# EAGLE schematic Diagrama Eletrônico V2.0 (EAGLE 9.5.1)
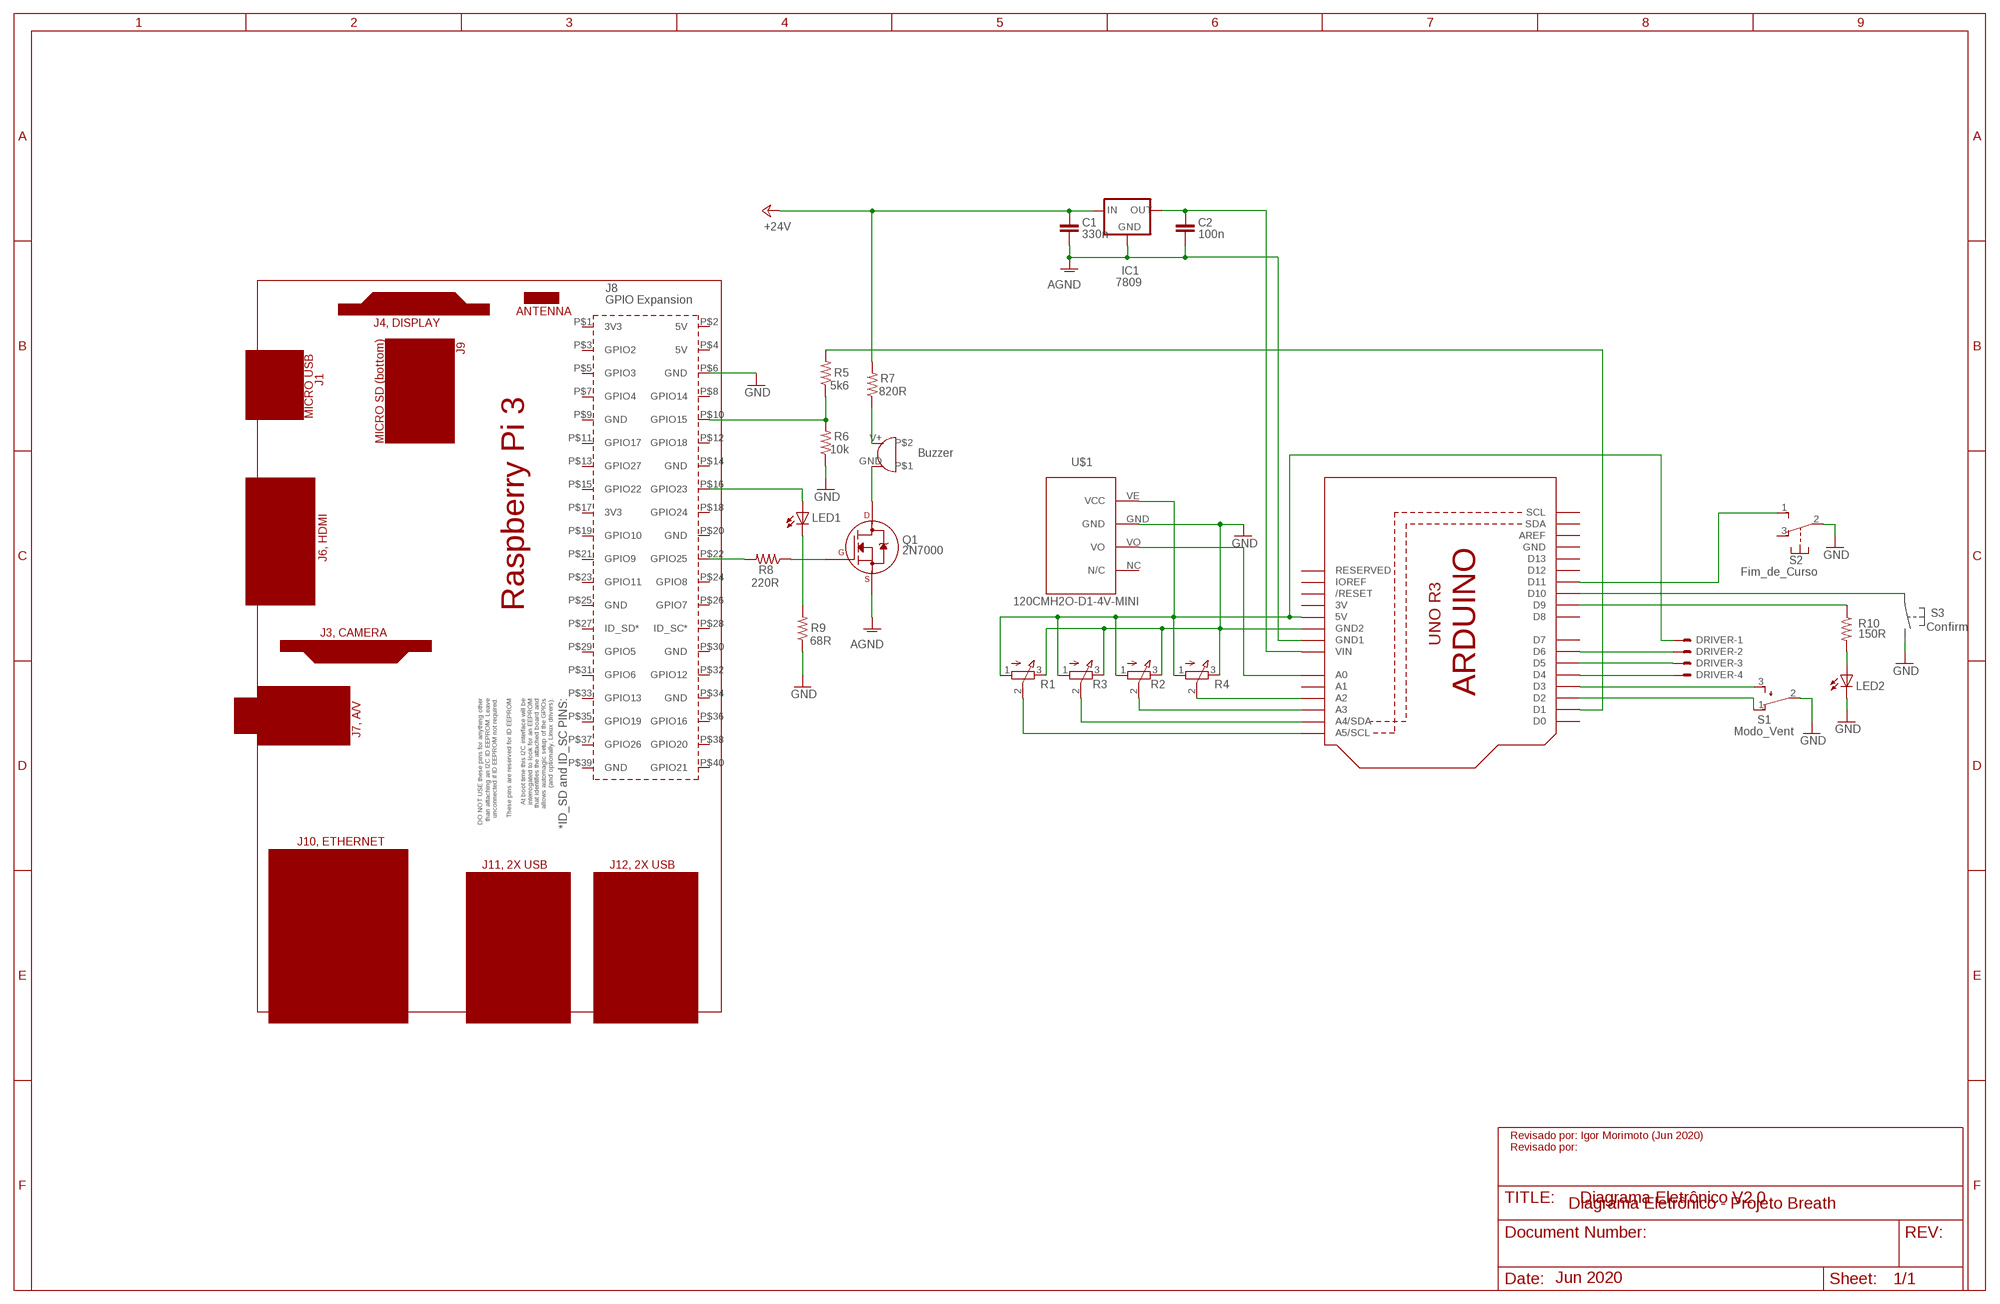
[diagram p0: schematic, sheet 1]
S3 (D-TS): FUNC: Confirm

## Parts
C1  330n  C2,5-3  [C2.5-3]
C2  100n  C2,5-3  [C2.5-3]
DRIVER  KK-156-4  [KK-156-4]
IC1  7809  78XXS  [78XXS]
LED1  LED5MM  [LED5MM]
LED2  LED5MM  [LED5MM]
PCB1  RPI3  [RPI3]
Q1  2N7000  2N7000_TO92  [TO-92]
R1  3RP/1610N  [3RP/1610N]
R2  3RP/1610N  [3RP/1610N]
R3  3RP/1610N  [3RP/1610N]
R4  3RP/1610N  [3RP/1610N]
R5  5k6  R-US_0207/10  [0207/10]
R6  10k  R-US_0207/10  [0207/10]
R7  820R  R-US_0207/10  [0207/10]
R8  220R  R-US_0207/10  [0207/10]
R9  68R  R-US_0207/10  [0207/10]
R10  150R  R-US_0207/10  [0207/10]
S1  Modo_Vent  TL32WO  [TL3XWO]
S2  Fim_de_Curso  9450-1  [9450-1]
U1  ARDUINOR3-DIMENSION  [ARDUINOR3]
U$1  120CMH2O-D1-4V-MINI  [4-SIP_MODULE]
U$2  BUZZER_SM-18V-C  [SM-18V-C]

## Nets
+24V: C1.1 IC1.IN R7.2
AGND: C1.2 C2.2 IC1.GND Q1.1(S) U1.GND1
GND: LED2.K(C) PCB1.P$6(GND) R1.3(E) R2.3(E) R3.3(E) R4.3(E) R6.1 R9.1 S1.2(P) S2.2(P) U1.GND2 U$1.GND
N$1: U1.D10
N$2: DRIVER.1 R1.1(A) R2.1(A) R3.1(A) R4.1(A) U1.5V U$1.VE(VCC)
N$3: R4.2(S) U1.A2
N$4: R2.2(S) U1.A3
N$5: R3.2(S) U1.A4(A4/SDA)
N$6: R1.2(S) U1.A5(A5/SCL)
N$7: C2.1 IC1.OUT U1.VIN
N$8: U1.A0 U$1.VO
N$9: DRIVER.2 U1.D6
N$10: DRIVER.3 U1.D5
N$11: DRIVER.4 U1.D4
N$12: PCB1.P$10(GPIO15) R5.1 R6.2
N$13: R5.2 U1.D1
N$14: S1.3(S) U1.D3
N$15: S1.1(O) U1.D2
N$16: LED1.A PCB1.P$16(GPIO23)
N$17: R10.1 U1.D9
N$18: S2.1(S) U1.D11
N$19: Q1.3(D) U$2.GND
N$20: R7.1 U$2.V+
N$21: PCB1.P$22(GPIO25) R8.2
N$22: Q1.2(G) R8.1
N$23: LED1.K(C) R9.2
N$24: LED2.A R10.2
Unconnected: PCB1.P$1(3V3) PCB1.P$2(5V) PCB1.P$3(GPIO2) PCB1.P$4(5V) PCB1.P$5(GPIO3) PCB1.P$7(GPIO4) PCB1.P$8(GPIO14) PCB1.P$9(GND) PCB1.P$11(GPIO17) PCB1.P$12(GPIO18) PCB1.P$13(GPIO27) PCB1.P$14(GND) PCB1.P$15(GPIO22) PCB1.P$17(3V3) PCB1.P$18(GPIO24) PCB1.P$19(GPIO10) PCB1.P$20(GND) PCB1.P$21(GPIO9) PCB1.P$23(GPIO11) PCB1.P$24(GPIO8) PCB1.P$25(GND) PCB1.P$26(GPIO7) PCB1.P$27(ID_SD*) PCB1.P$28(ID_SC*) PCB1.P$29(GPIO5) PCB1.P$30(GND) PCB1.P$31(GPIO6) PCB1.P$32(GPIO12) PCB1.P$33(GPIO13) PCB1.P$34(GND) PCB1.P$35(GPIO19) PCB1.P$36(GPIO16) PCB1.P$37(GPIO26) PCB1.P$38(GPIO20) PCB1.P$39(GND) PCB1.P$40(GPIO21) S2.3(O) U1.A1 U1.AREF U1.D0 U1.D7 U1.D8 U1.D12 U1.D13 U1.IOREF U1.RESERVED U1.RESET(/RESET) U1.SCL U1.SDA U$1.NC(N/C)

## Notes on the sheet
- Revisado por: Igor Morimoto (Jun 2020)
- Revisado por:
- Diagrama Eletrônico - Projeto Breath
- Jun 2020

## Power pins joined to a net without a drawn wire
3V: U1.3V
GND: U1.GND

## Library data of the parts
C1 C2 = capacitor-wima:C: CAPACITOR naming: grid - package width
DRIVER = con-molex:KK-156-4: KK 156 HEADER Source: http://www.molex.com/pdm_docs/sd/026604100_sd.pdf; MF: MOLEX; OC_FARNELL: unknown; OC_NEWARK: unknown
IC1 = v-reg:78XXS: VOLTAGE REGULATOR
LED1 LED2 = adafruit:LED: LED OSRAM: - CHIPLED LG R971, LG N971, LY N971, LG Q971, LY Q971, LO R971, LY R971 LH N974, LH R974 LS Q976, LO Q976, LY Q976 LO Q996 - Hyper CHIPLED LW Q18S LB Q993, LB Q99A, LB R99A - SideLED LS A670, LO A670, LY A670, LG A670, LP A670 LB A673, LV A673, LT A673, LW A673 LH A674 LY A675 LS A676, LA A676, LO A676, LY A676, LW A676 LS A679, LY A679, LG A679 - Hyper Micro SIDELED® LS Y876, LA Y876, LO Y876, LY Y876 LT Y87S - SmartLED LW L88C, LW L88S LB L89C, LB L89S, LG L890 LS L89K, LO L89K, LY L89K LS L896, LA L896, LO L896, LY L896 - TOPLED LS T670, LO T670, LY T670, LG T670, LP T670 LSG T670, LSP T670, LSY T670, LOP T670, LYG T670 LG T671, LOG T671, LSG T671 LB T673, LV T673, LT T673, LW T673 LH T674 LS T676, LA T676, LO T676, LY T676, LB T676, LH T676, LSB T676, LW T676 LB T67C, LV T67C, LT T67C, LS T67K, LO T67K, LY T67K, LW E67C LS E67B, LA E67B, LO E67B, LY E67B, LB E67C, LV E67C, LT E67C LW T67C LS T679, LY T679, LG T679 LS T770, LO T770, LY T770, LG T770, LP T770 LB T773, LV T773, LT T773, LW T773 LH T774 LS E675, LA E675, LY E675, LS T675 LS T776, LA T776, LO T776, LY T776, LB T776 LHGB T686 LT T68C, LB T68C - Hyper Mini TOPLED® LB M676 - Mini TOPLED Santana® LG M470 LS M47K, LO M47K, LY M47K Source: http://www.osram.convergy.de/
PCB1 = e14_Rpi3_RevA:RPI3: Device for Raspberry Pi 3 board created by Dave Young for www.element14.com More information and support community is available at https://www.element14.com/community/community/raspberry-pi
Q1 = transistors:2N700*: 2N7000, 2N7002, NDS7002A N-channel enhancement mode MOSFET
R1-R4 = pot:3RP/1610N: 16mm Potentiometer one level Source: http://www.alphapotentiometers.net/html/16mm_pot_2.html
R5-R10 = rcl:R-US_: RESISTOR, American symbol; SPICEPREFIX: R
S1 = switch:TL32WO: TINY SWITCH ON - MOM Source: http://www2.produktinfo.conrad.com/datenblaetter/700000-724999/705152-da-01-de-Subminiaturschalter_TL_36WO.pdf
S2 = switch-misc:9450-1: MARQUARDT SWITCH
U1 = adafruit:ARDUINOR3: This is a new object for the new Arduino R3 - with extra pins that you may want to use (such as IOref, and duplicated A4/A5
U$1 = Autoral:120CMH2O-D1-4V-MINI
U$2 = Autoral:BUZZER_SM-18V-C; NM: Buzzer